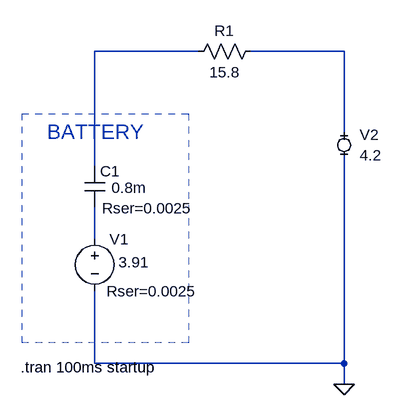
[diagram p0: schematic joke.asc]
joke.asc, the LTspice schematic file:
Version 4
SHEET 1 880 680
WIRE 80 -96 -80 -96
WIRE 304 -96 160 -96
WIRE 304 32 304 -96
WIRE -80 80 -80 -96
WIRE -80 192 -80 144
WIRE -80 384 -80 272
WIRE 304 384 304 64
WIRE 304 384 -80 384
WIRE 304 416 304 384
FLAG 304 416 0
SYMBOL voltage -80 176 R0
WINDOW 3 37 52 Left 2
WINDOW 123 24 138 Left 2
WINDOW 39 18 97 Left 2
WINDOW 0 23 17 Left 2
SYMATTR Value 3.91
SYMATTR SpiceLine Rser=0.0025
SYMATTR InstName V1
SYMBOL cap -96 80 R0
WINDOW 3 42 34 Left 2
WINDOW 39 27 65 Left 2
WINDOW 40 24 98 Left 2
SYMATTR Value 0.8m
SYMATTR SpiceLine Rser=0.0025
SYMATTR InstName C1
SYMBOL res 64 -80 R270
WINDOW 0 32 56 VTop 2
WINDOW 3 0 56 VBottom 2
SYMATTR InstName R1
SYMATTR Value 15.8
SYMATTR SpiceLine pwr=15
SYMBOL MiniSyms4\\voltage- 304 48 R0
WINDOW 123 0 0 Left 2
WINDOW 39 0 0 Left 2
SYMATTR InstName V2
SYMATTR Value 4.2
TEXT -80 48 Bottom 3 ;BATTERY
TEXT -194 390 Left 2 !.tran 100ms startup
RECTANGLE Normal 64 352 -192 0 2

The netlist it stands for:
* joke.asc
V1 N003 0 3.91 Rser=0.0025
C1 N001 N003 0.8m Rser=0.0025
R1 N001 N002 15.8 pwr=15
V2 N002 0 4.2
* BATTERY
.tran 100ms startup
.backanno
.end